# EAGLE schematic skyboard (EAGLE 9.6.2)
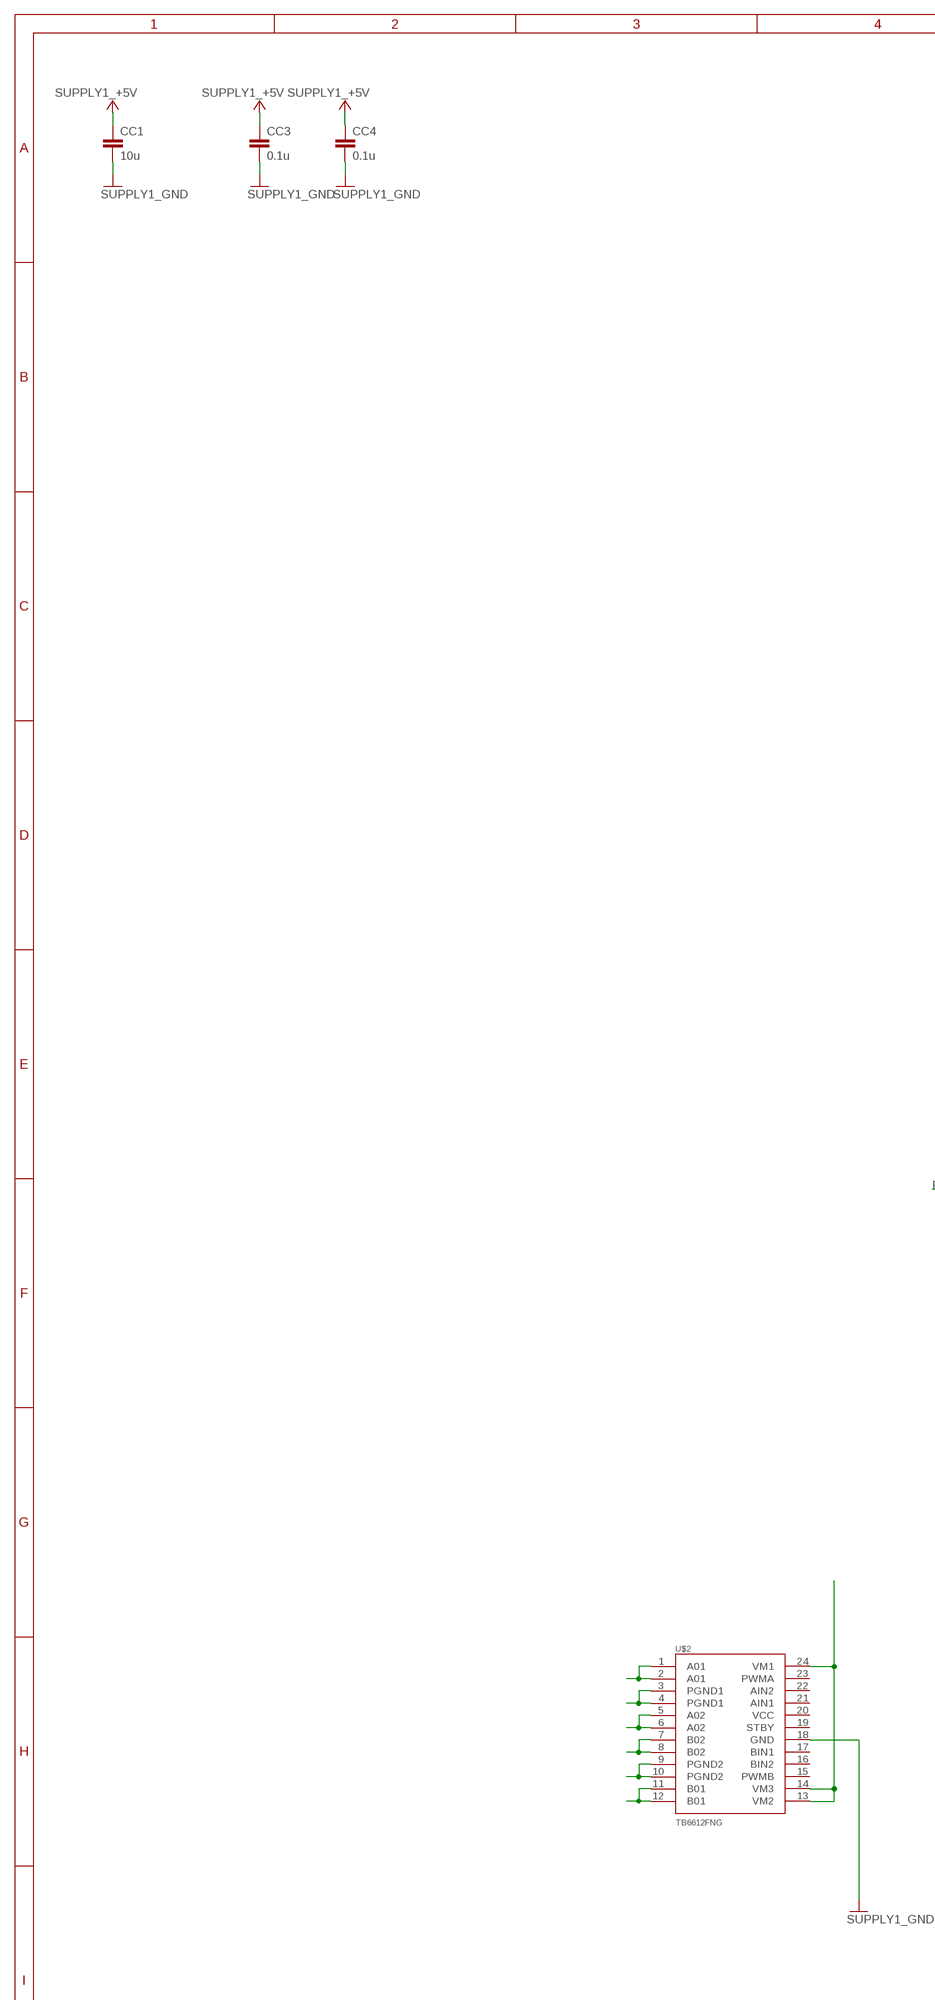
[diagram p0: schematic, sheet 1, part 1 of 2]
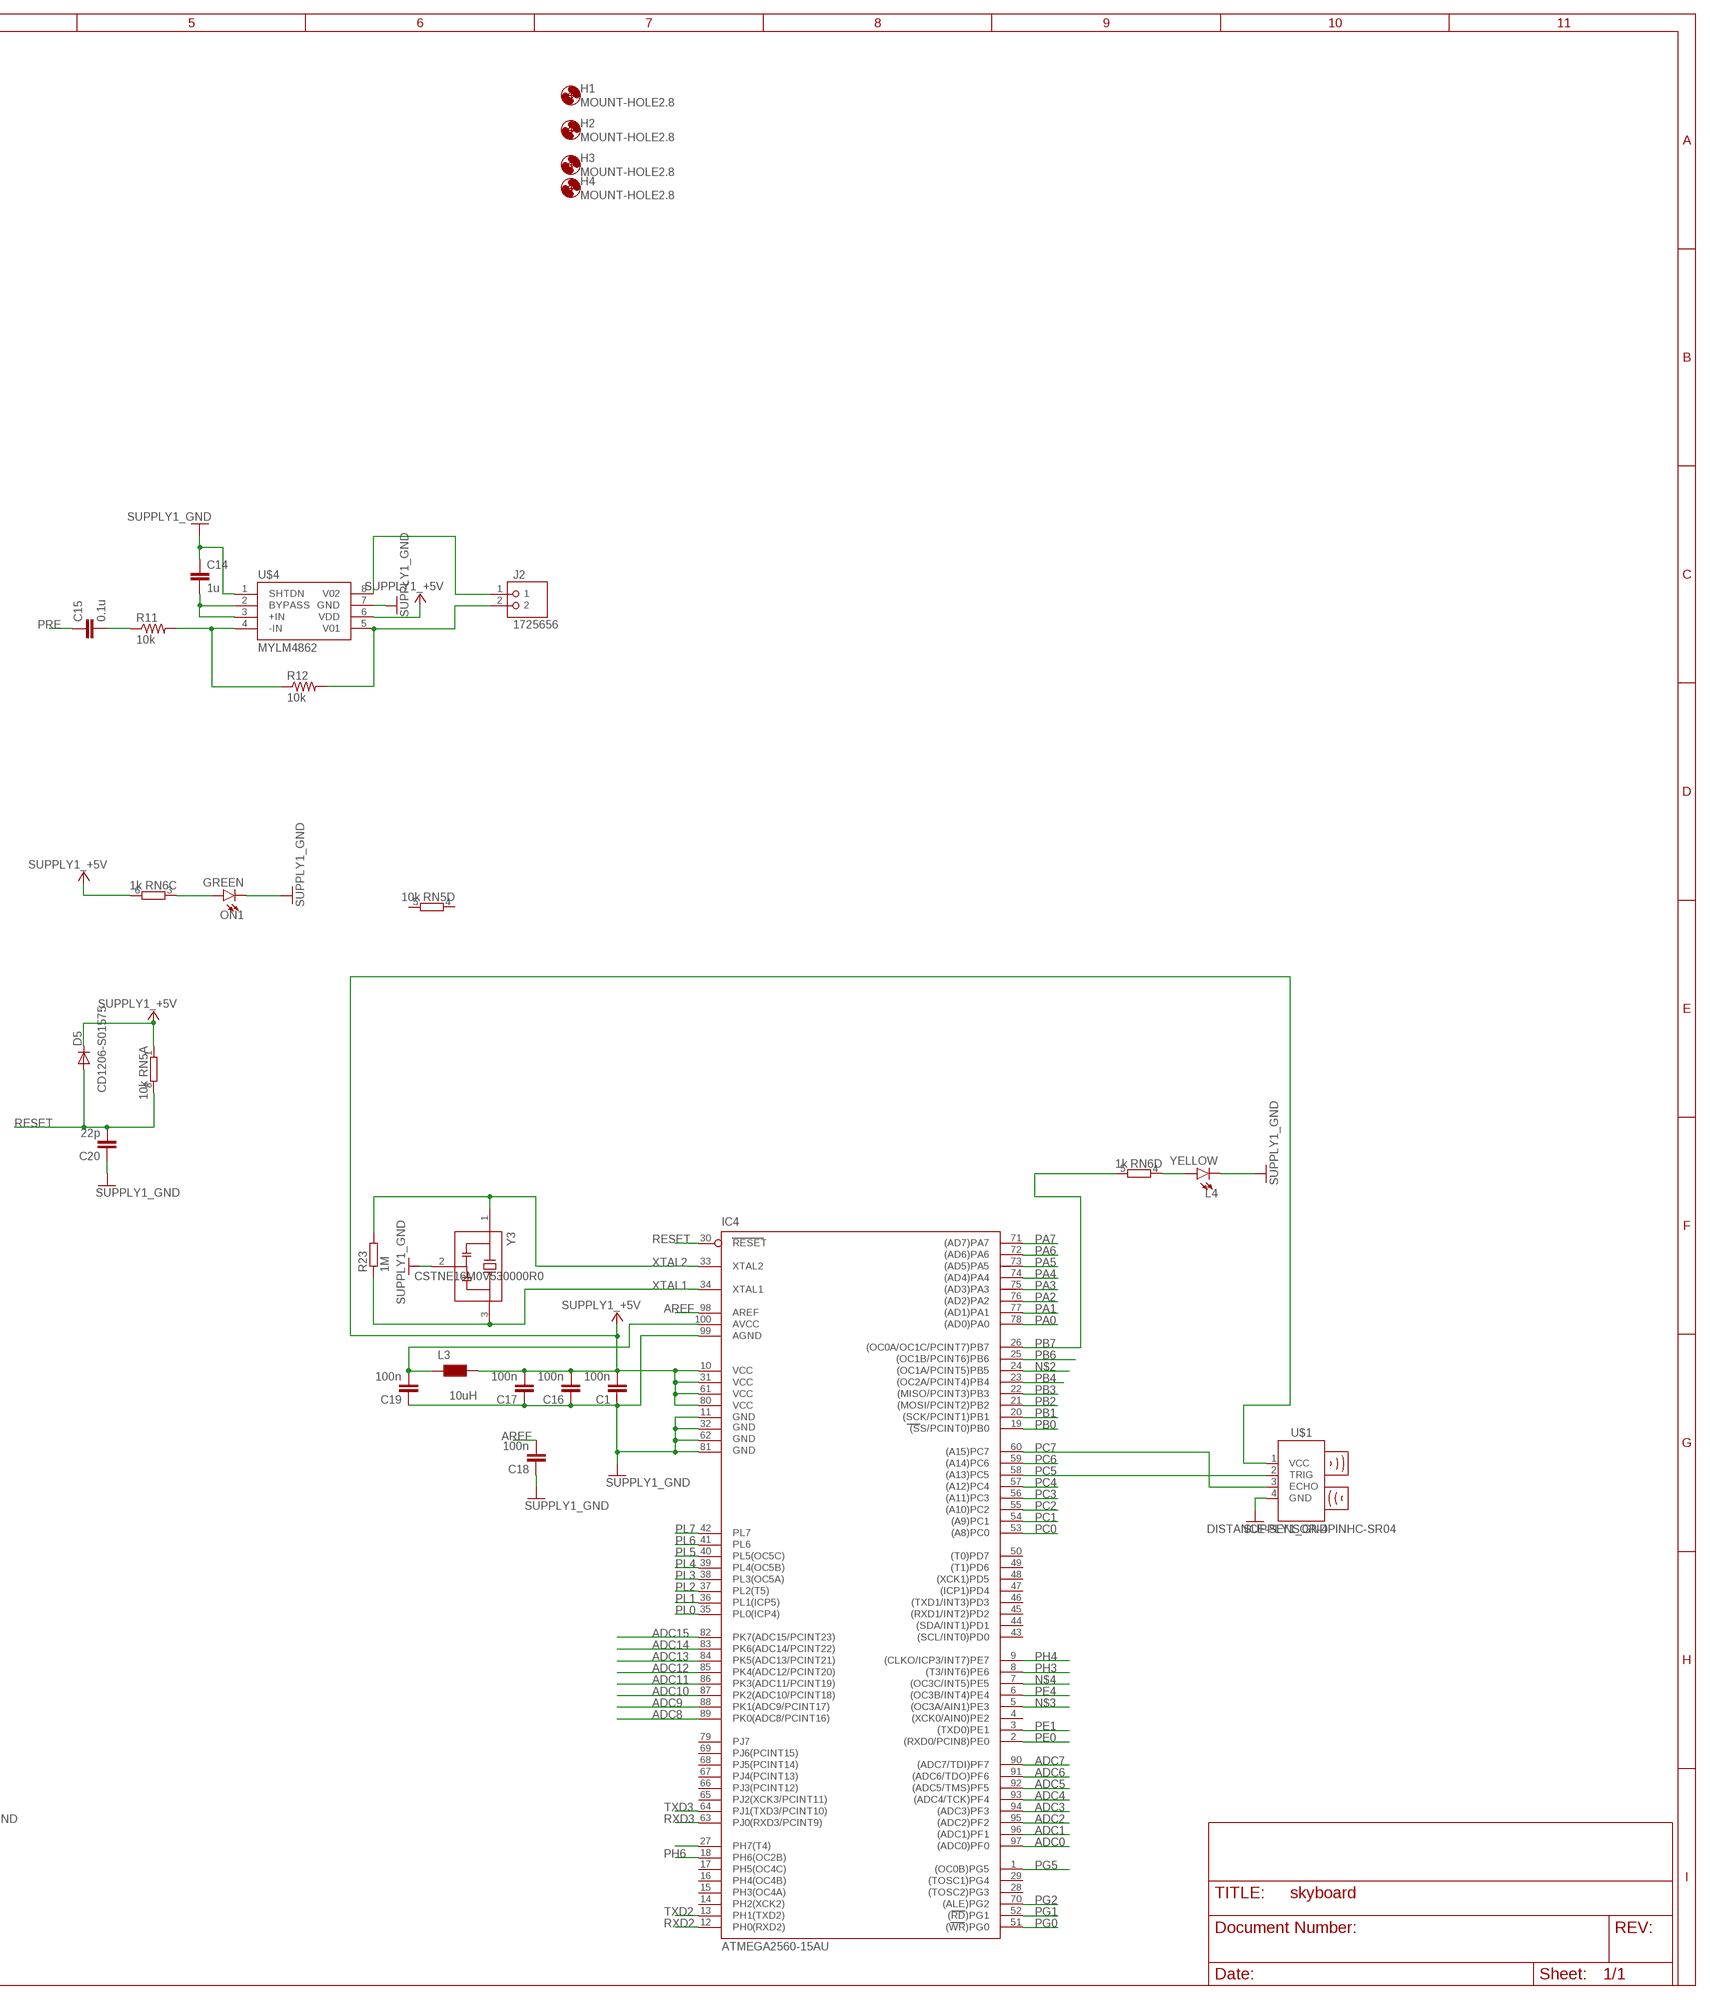
[diagram p1: schematic, sheet 1, part 2 of 2]

## Parts
C1  100n  SMARTPRJ_C-EUC1206  [SMARTPRJ_C1206]
C14  1u  SMARTPRJ_C-EUC1206  [SMARTPRJ_C1206]
C15  0.1u  SMARTPRJ_C-EUC1206  [SMARTPRJ_C1206]
C16  100n  SMARTPRJ_C-EUC1206  [SMARTPRJ_C1206]
C17  100n  SMARTPRJ_C-EUC1206  [SMARTPRJ_C1206]
C18  100n  SMARTPRJ_C-EUC1206  [SMARTPRJ_C1206]
C19  100n  SMARTPRJ_C-EUC1206  [SMARTPRJ_C1206]
C20  22p  SMARTPRJ_C-EUC1206  [SMARTPRJ_C1206]
CC1  10u  SMARTPRJ_C-EUC1206  [SMARTPRJ_C1206]
CC3  0.1u  SMARTPRJ_C-EUC1206  [SMARTPRJ_C1206]
CC4  0.1u  SMARTPRJ_C-EUC1206  [SMARTPRJ_C1206]
D5  CD1206-S01575  DIODE_DIODE-MINIMELF  [DIODE_MINIMELF]
H1  MOUNT-HOLE2.8  [2,8]
H2  MOUNT-HOLE2.8  [2,8]
H3  MOUNT-HOLE2.8  [2,8]
H4  MOUNT-HOLE2.8  [2,8]
IC4  ATMEGA2560-15AU  INTEGRATEDCIRCUITS_0023_ATMEGA2560-16AU  [INTEGRATEDCIRCUITS_TQFP100]
J2  1725656  [PHOENIX_1725656]
L3  10uH  INDUTTANZE_0715_CV201210-100K  [INDUTTANZE_0805]
L4  YELLOW  LED1206  [LED-1206]
ON1  GREEN  LED1206  [LED-1206]
R11  10k  R-US_R1206  [R1206]
R12  10k  R-US_R1206  [R1206]
R23  1M  SMARTPRJ_R-EU_R1206  [SMARTPRJ_R1206]
RN5  10k  RESISTOR-DIL_4R-NCAY16  [RESISTOR-DIL_CAY16]
RN6  1k  RESISTOR-DIL_4R-NCAY16  [RESISTOR-DIL_CAY16]
U$1  DISTANCE-SENSOR-4PINHC-SR04  [HC-SR04]
U$2  TB6612FNG  [SSOP24]
U$4  MYLM4862  [MYSOIC8]
Y3  CSTNE16M0V530000R0  [OSC_CSTNE16M0V530000R0]

## Nets
ADC0: IC4.97((ADC0)PF0)
ADC1: IC4.96((ADC1)PF1)
ADC2: IC4.95((ADC2)PF2)
ADC3: IC4.94((ADC3)PF3)
ADC4: IC4.93((ADC4/TCK)PF4)
ADC5: IC4.92((ADC5/TMS)PF5)
ADC6: IC4.91((ADC6/TDO)PF6)
ADC7: IC4.90((ADC7/TDI)PF7)
ADC8: IC4.89(PK0(ADC8/PCINT16))
ADC9: IC4.88(PK1(ADC9/PCINT17))
ADC10: IC4.87(PK2(ADC10/PCINT18))
ADC11: IC4.86(PK3(ADC11/PCINT19))
ADC12: IC4.85(PK4(ADC12/PCINT20))
ADC13: IC4.84(PK5(ADC13/PCINT21))
ADC14: IC4.83(PK6(ADC14/PCINT22))
ADC15: IC4.82(PK7(ADC15/PCINT23))
AREF: C18.2 IC4.98(AREF)
GND: C1.1 C14.1 C16.1 C17.1 C18.1 C19.1 C20.1 CC1.2 CC3.2 CC4.2 IC4.11(GND) IC4.32(GND1) IC4.62(GND2) IC4.81(GND3) IC4.99(AGND) L4.C ON1.C U$1.4(GND) U$2.18(GND) U$4.1(SHTDN) U$4.7(GND) Y3.2(GND) ; supply symbol labelled SUPPLY1_GND
N$1: U$2.1(A01) U$2.2(A01)
N$2: IC4.24((OC1A/PCINT5)PB5)
N$3: IC4.5((OC3A/AIN1)PE3)
N$4: IC4.7((OC3C/INT5)PE5)
N$6: U$2.11(B01) U$2.12(B01)
N$8: U$2.7(B02) U$2.8(B02)
N$9: ON1.A RN6.3
N$11: U$2.5(A02) U$2.6(A02)
N$13: U$2.3(PGND1) U$2.4(PGND1)
N$14: C14.2 U$4.2(BYPASS) U$4.3(+IN)
N$15: R11.2 R12.1 U$4.4(-IN)
N$16: C15.2 R11.1
N$17: J2.2 R12.2 U$4.5(V01)
N$18: J2.1 U$4.8(V02)
N$20: U$2.9(PGND2) U$2.10(PGND2)
N$22: U$2.13(VM2) U$2.14(VM3) U$2.24(VM1)
N$24: C19.2 IC4.100(AVCC) L3.1
N$26: L4.A RN6.4
N$124: IC4.27(PH7(T4))
PA0: IC4.78((AD0)PA0)
PA1: IC4.77((AD1)PA1)
PA2: IC4.76((AD2)PA2)
PA3: IC4.75((AD3)PA3)
PA4: IC4.74((AD4)PA4)
PA5: IC4.73((AD5)PA5)
PA6: IC4.72((AD6)PA6)
PA7: IC4.71((AD7)PA7)
PB0: IC4.19((SS/PCINT0)PB0)
PB1: IC4.20((SCK/PCINT1)PB1)
PB2: IC4.21((MOSI/PCINT2)PB2)
PB3: IC4.22((MISO/PCINT3)PB3)
PB4: IC4.23((OC2A/PCINT4)PB4)
PB6: IC4.25((OC1B/PCINT6)PB6)
PB7: IC4.26((OC0A/OC1C/PCINT7)PB7) RN6.5
PC0: IC4.53((A8)PC0)
PC1: IC4.54((A9)PC1)
PC2: IC4.55((A10)PC2)
PC3: IC4.56((A11)PC3)
PC4: IC4.57((A12)PC4)
PC5: IC4.58((A13)PC5) U$1.2(TRIG)
PC6: IC4.59((A14)PC6)
PC7: IC4.60((A15)PC7) U$1.3(ECHO)
PE0: IC4.2((RXD0/PCIN8)PE0)
PE1: IC4.3((TXD0)PE1)
PE4: IC4.6((OC3B/INT4)PE4)
PG0: IC4.51((WR)PG0)
PG1: IC4.52((RD)PG1)
PG2: IC4.70((ALE)PG2)
PG5: IC4.1((OC0B)PG5)
PH3: IC4.8((T3/INT6)PE6)
PH4: IC4.9((CLKO/ICP3/INT7)PE7)
PH6: IC4.18(PH6(OC2B))
PL0: IC4.35(PL0(ICP4))
PL1: IC4.36(PL1(ICP5))
PL2: IC4.37(PL2(T5))
PL3: IC4.38(PL3(OC5A))
PL4: IC4.39(PL4(OC5B))
PL5: IC4.40(PL5(OC5C))
PL6: IC4.41(PL6)
PL7: IC4.42(PL7)
PRE: C15.1
RESET: C20.2 D5.A IC4.30(RESET) RN5.8
RXD2: IC4.12(PH0(RXD2))
RXD3: IC4.63(PJ0(RXD3/PCINT9))
SUPPLY1_+5V: C1.2 C16.2 C17.2 CC1.1 CC3.1 CC4.1 D5.C IC4.10(VCC) IC4.31(VCC1) IC4.61(VCC2) IC4.80(VCC3) L3.2 RN5.1 RN6.6 U$1.1(VCC) U$4.6(VDD)
TXD2: IC4.13(PH1(TXD2))
TXD3: IC4.64(PJ1(TXD3/PCINT10))
XTAL1: IC4.34(XTAL1) R23.1 Y3.3(OUT)
XTAL2: IC4.33(XTAL2) R23.2 Y3.1(IN)
Unconnected: IC4.4((XCK0/AIN0)PE2) IC4.14(PH2(XCK2)) IC4.15(PH3(OC4A)) IC4.16(PH4(OC4B)) IC4.17(PH5(OC4C)) IC4.28((TOSC2)PG3) IC4.29((TOSC1)PG4) IC4.43((SCL/INT0)PD0) IC4.44((SDA/INT1)PD1) IC4.45((RXD1/INT2)PD2) IC4.46((TXD1/INT3)PD3) IC4.47((ICP1)PD4) IC4.48((XCK1)PD5) IC4.49((T1)PD6) IC4.50((T0)PD7) IC4.65(PJ2(XCK3/PCINT11)) IC4.66(PJ3(PCINT12)) IC4.67(PJ4(PCINT13)) IC4.68(PJ5(PCINT14)) IC4.69(PJ6(PCINT15)) IC4.79(PJ7) RN5.2 RN5.3 RN5.4 RN5.5 RN5.6 RN5.7 RN6.1 RN6.2 RN6.7 RN6.8 U$2.15(PWMB) U$2.16(BIN2) U$2.17(BIN1) U$2.19(STBY) U$2.20(VCC) U$2.21(AIN1) U$2.22(AIN2) U$2.23(PWMA)

## Library data of the parts
C1 C14-C20 CC1 CC3 CC4 = UNO-TH_Rev3e:SMARTPRJ_C-EU: CAPACITOR, European symbol
D5 = UNO-TH_Rev3e:DIODE_DIODE-: DIODE
H1-H4 = holes:MOUNT-HOLE: MOUNTING HOLE with drill center marker
IC4 = MEGA2560_Rev3e:INTEGRATEDCIRCUITS_0023_ATMEGA2560-16AU: 8-bit Microcontroller with 256K Bytes In-System Programmable Flash - ATMEGA2560-16AU; CASE: TQFP100_14x14; MONTHLY_USAGE: _____; PART_NUMBER: ATMEGA2560-16AU; PRICE: _____; SUPPLIER: _____; TYPE: Circuito_Integrato
J2 = 1725656:1725656; MANUFACTURER: Phoenix Contact; MAXIMUM_PACKAGE_HEIGHT: 8.65mm; PARTREV: 03.03.2021; STANDARD: Manufacturer Recommendations
L3 = UNO-TH_Rev3e:INDUTTANZE_0715_CV201210-100K: 10uH 0805; CASE: 0805; MONTHLY_USAGE: _____; PART_NUMBER: CV201210-100K; PRICE: _____; SUPPLIER: _____; TYPE: Induttanze
L4 ON1 = SparkFun-LED:LED: LED (Generic) Standard schematic elements and footprints for 5mm, 3mm, 1206, and 0603 sized LEDs. Generic LEDs with no color specified.
R11 R12 = resistor_3rdPin_v20:R-US_: RESISTOR, American symbol
R23 = UNO-TH_Rev3e:SMARTPRJ_R-EU_: RESISTOR, European symbol
RN5 RN6 = UNO-TH_Rev3e:RESISTOR-DIL_4R-N: Array Chip Resistor Source: RS Component / Phycomp
U$1 = Tinkercad:DISTANCE-SENSOR-4PIN
U$2 = SparkFun-IC-Special-Function:TB6612FNG: Toshiba 1A dual motor driver IC-09363; PROD_ID: IC-09363
U$4 = LM4862M_NOPB:MYLM4862
Y3 = CSTNE16M0V530000R0:CSTNE16M0V530000R0; MANUFACTURER: Murata; MAXIMUM_PACKAGE_HEIGHT: 1mm; PARTREV: JGC42-8853B; STANDARD: Manufacturer Recomendations

## Net classes
0 default: width 0.305 mm
1 Power: width 0.508 mm